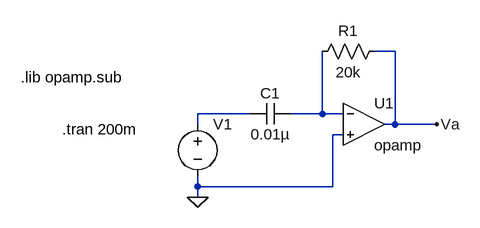
[diagram p0: schematic opamp1.asc]
opamp1.asc, the LTspice schematic file:
Version 4.1
SHEET 1 880 680
WIRE 416 0 384 0
WIRE 192 96 112 96
WIRE 304 96 304 0
WIRE 304 96 256 96
WIRE 336 96 304 96
WIRE 112 112 112 96
WIRE 416 112 416 0
WIRE 416 112 400 112
WIRE 480 112 416 112
WIRE 336 128 320 128
WIRE 112 208 112 192
WIRE 320 208 320 128
WIRE 320 208 112 208
WIRE 112 224 112 208
FLAG 112 224 0
FLAG 480 112 Va
SYMBOL cap 256 80 R90
WINDOW 0 0 32 VBottom 2
WINDOW 3 32 32 VTop 2
SYMATTR InstName C1
SYMATTR Value 0.01µ
SYMBOL voltage 112 96 R0
WINDOW 3 -112 160 Left 2
WINDOW 123 0 0 Left 0
WINDOW 39 0 0 Left 0
SYMATTR InstName V1
SYMATTR Value ""
SYMBOL res 400 -16 R90
WINDOW 0 0 56 VBottom 2
WINDOW 3 32 56 VTop 2
SYMATTR InstName R1
SYMATTR Value 20k
SYMBOL OpAmps\\opamp 368 48 R0
SYMATTR InstName U1
TEXT -96 120 Left 2 !.tran 200m
TEXT -160 40 Left 2 !.lib opamp.sub

The netlist it stands for:
* opamp1.asc
C1 N002 N001 0.01µ
V1 N001 0
R1 Va N002 20k
X§U1 N002 0 Va opamp Aol=100K GBW=10Meg  ; pins invin noninvin out
.tran 200m
.lib opamp.sub
.backanno
.end